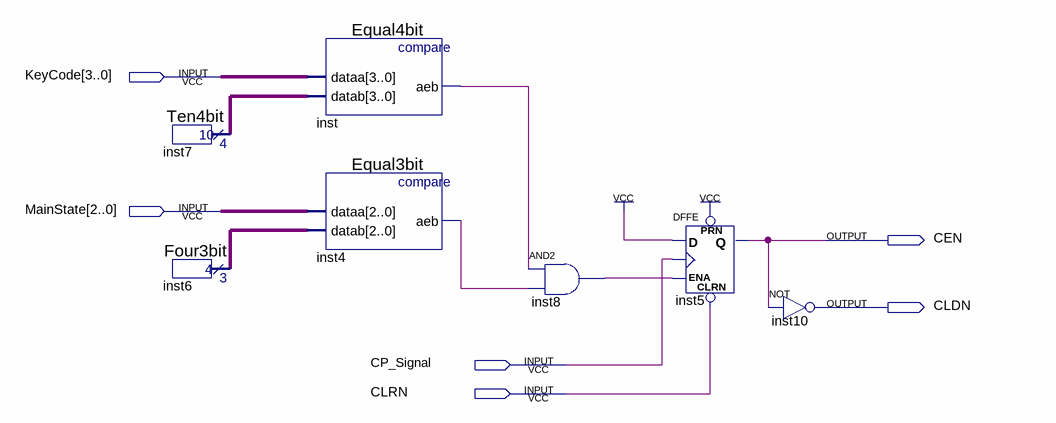
[diagram p0: schematic sheet]
// Quartus schematic CountDownControl.bdf as structural Verilog: 7 symbols, 6 pins
module CountDownControl (
  input  [3:0] KeyCode,
  input  [2:0] MainState,
  input  CP_Signal,
  input  CLRN,
  output CEN,
  output CLDN
);

  wire inst4_aeb, inst8_out, inst_aeb;
  wire [2:0] inst6_result;
  wire [3:0] inst7_result;

  Ten4bit inst7 (.result(inst7_result));
  Four3bit inst6 (.result(inst6_result));
  Equal4bit inst (.dataa(KeyCode), .datab(inst7_result), .aeb(inst_aeb));
  Equal3bit inst4 (.dataa(MainState), .datab(inst6_result), .aeb(inst4_aeb));
  and inst8 (inst8_out, inst_aeb, inst4_aeb);
  DFFE inst5 (.PRN(1'b1), .CLRN(CLRN), .D(1'b1), .CLK(CP_Signal), .ENA(inst8_out), .Q(CEN));
  not inst10 (CLDN, CEN);
endmodule
